# EAGLE design succh_punker (EAGLE 9.6.2)
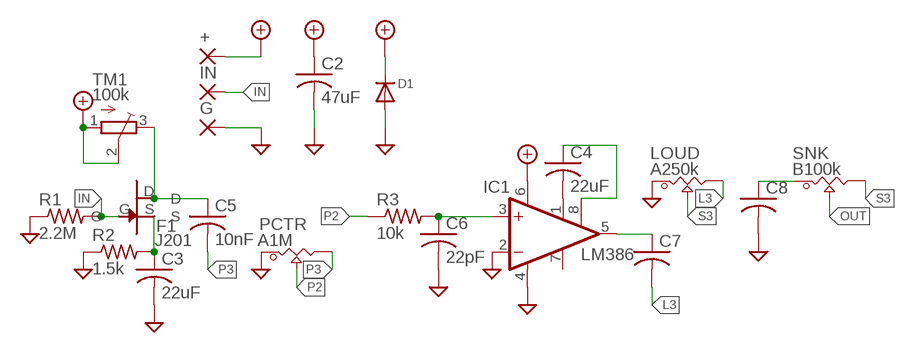
[diagram p0: schematic, sheet 1]

## Parts
+  SMD2  [SMD1,27-2,54]
C2  47uF  C-USC1210  [C1210]
C3  22uF  C-USC1210  [C1210]
C4  22uF  C-USC1210  [C1210]
C5  10nF  C-USC0603  [C0603]
C6  22pF  C-USC0603  [C0603]
C7  C-USC0603  [C0603]
C8  C-USC0603  [C0603]
D1  DIODESOD-123  [SOD-123]
F1  J201  MMBFJ201  [MMBFJ201]
G  SMD2  [SMD1,27-2,54]
IC1  LM386  LM386M-1  [SO08]
IN  SMD2  [SMD1,27-2,54]
LOUD  A250k  POT_9MM_SMD  [POT_9MM_SMD]
PCTR  A1M  POT_9MM_SMD  [POT_9MM_SMD]
R1  2.2M  R-US_R0603  [R0603]
R2  1.5k  R-US_R0603  [R0603]
R3  10k  R-US_R0603  [R0603]
SNK  B100k  POT_9MM_SMD  [POT_9MM_SMD]
TM1  100k  TRIMPOTTC33X  [TC33X]

## Nets
+9V: +.1(P) C2.1 D1.C IC1.6(VS) TM1.1(A) TM1.2(S)
F1_D: C5.1 F1.D TM1.3(E)
F1_S: C3.1 F1.S R2.2
GND: C2.2 C3.2 C6.2 C8.2 D1.A G.1(P) IC1.2(-IN) IC1.4(GND) LOUD.1 PCTR.1 R1.1 R2.1
IN: F1.G IN.1(P) R1.2
L3: C7.2 LOUD.3
N$5: C4.2 IC1.1(GAIN)
N$6: C8.1 SNK.1
N$7: C4.1 IC1.8(GAIN)
OA_+: C6.1 IC1.3(+IN) R3.2
OA_O: C7.1 IC1.5(OUT)
OUT: SNK.2
P2: PCTR.2 R3.1
P3: C5.2 PCTR.3
S3: LOUD.2 SNK.3
Unconnected: IC1.7(BYPASS)

## Library data of the parts
+ G IN = wirepad:SMD2: SMD PAD
C2-C8 = adafruit:C-US: CAPACITOR, American symbol
D1 = adafruit:DIODE: Diode SMADIODE - SMA Surface Mount Package 20V 1A Schottky Diode Digikey: 641-1014-6-ND DO-1N4148 - Through Hole Small Current Diode SOD-123 20V 1 A (.5mV Vf) Schottky Diode - Digikey: MBRX120TPMSCT-ND SOD-323 10V 570mA (.38mV Vf, 3ns) Schottky Diode - Digikey: ZLLS410CT-ND SOD-523 30V 30mA Schottky Diode (RB751S-40TE61) - Digikey: RB751S-40TE61CT-ND SOT23-R/W - SOT23 Package (R = Solder Paste/Reflow Ovens, W = Hand-Soldering) BAT54Film 40V 300mA - Digikey: 497-7162-1-ND
F1 = SOT95P240X110-3N:MMBFJ201
IC1 = linear:LM386?-*: Low Voltage Audio Power Amplifier Source: http://cache.national.com/ds/LM/LM386.pdf
LOUD PCTR SNK = Potentiometers_SMD:POT_9MM_SMD
R1-R3 = adafruit:R-US_: RESISTOR, American symbol
TM1 = adafruit:TRIMPOT: SMT trimmer potentiometer part number TC33X http://www.ladyada.net/library/eagle

## Board
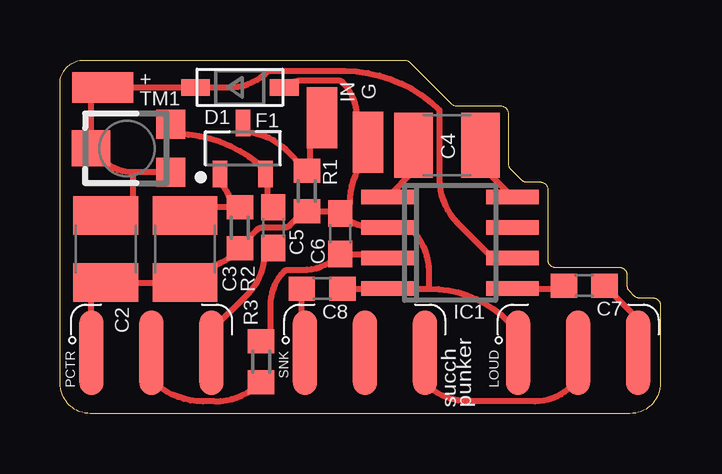
[diagram p1: board, top side]

Size 25.02 x 14.73 mm. Coordinates in mm from the lower left corner, seen from the top.
Outline: 25.02,4.51 25.02,1.27 arc-90 23.75,0 1.27,0 arc-90 0,1.27 0,13.73 arc-90 1,14.73 14.35,14.73 arc-45 14.57,14.64 16.29,12.92 arc45 16.52,12.83 18.35,12.83 arc-90 18.67,12.51 18.67,10.42 arc45 18.76,10.19 19.21,9.74 arc45 19.44,9.65 20,9.65 arc-90 20.32,9.34 20.32,6.41 arc90 20.64,6.1 23.3,6.1 arc-90 23.62,5.78 23.62,5.34 arc45 23.71,5.11 23.91,4.92 arc45 24.14,4.83 24.7,4.83 arc-90 25.02,4.51
Copper layers (1*16): Top 0.035mm / dielectric 1.5mm / Bottom 0.035mm
Design rules "default *": minimum track width 6mil, minimum drill 0.35mm, track to track 6mil, track to pad 6mil, pad to pad 6mil, via to via 6mil, smd to smd 6mil, copper to edge 10mil, drill to drill 6mil, minimum pad ring 10mil, minimum via ring 8mil, stop-mask expansion 4mil, vias tented up to drill 0mil, thermal gap 10mil

### Footprints (pad centres in the part's own frame; a part is rotated, then mirrored left to right if it is on the bottom)
SMD1,27-2,54 = smd 1.27 x 2.54: 1 0,0
C1210 = smd 1.6 x 2.7: 1 -1.4,0; 2 1.4,0
C0603 = smd 1.1 x 1: 1 -0.85,0; 2 0.85,0
SOD-123 = smd 1.2 x 0.7: A 1.85,0; C -1.85,0
MMBFJ201 = smd 1.099 x 0.602: D -1.065,-0.95; G 1.065,0; S -1.065,0.95
SO08 = smd 0.6 x 2.2: 1 -1.905,-2.6; 2 -0.635,-2.6; 3 0.635,-2.6; 4 1.905,-2.6; 5 1.905,2.6; 6 0.635,2.6; 7 -0.635,2.6; 8 -1.905,2.6
POT_9MM_SMD = smd 0.991 x 3.505: 1 -2.5,0; 2 0,0; 3 2.5,0
R0603 = smd 1 x 1.1: 1 -0.85,0; 2 0.85,0
TC33X = smd 1.2 x 1.2: 1 -1,-1.825; 3 1,-1.825 | smd 1.5 x 1.6: 2 0,1.5

### Placement (x,y rotation side)
+  1.78,13.59 90 top
C2  1.91,6.86 270 top
C3  5.21,6.86 270 top
C4  16.13,11.18 180 top
C5  8.89,7.75 270 top
C6  11.68,7.49 90 top
C7  21.84,5.33 0 top
C8  10.92,5.21 0 top
D1  7.49,13.59 0 top
F1  7.62,11.05 90 top
G  12.83,11.3 0 top
IC1  16.26,7.11 270 top
IN  10.92,12.32 0 top
LOUD  21.59,2.54 0 top
PCTR  3.81,2.54 0 top
R1  10.29,9.27 90 top
R2  7.49,7.75 90 top
R3  8.38,2.16 90 top
SNK  12.7,2.54 0 top
TM1  2.79,11.05 90 top

### Tracks (layer width: path | path; a pad name or v marks a point on that pad's centre or on a via)
+9V
  Top 0.254: TM1.1 3.05,10.05 | 3.05,10.05 arc-45 1.76,10.58 TM1.2 1.29,13.11 +.1 D1.C 7.03,13.59 arc45 8.68,14.28 11.87,14.28 arc-45 15.81,12.64 15.81,9.76 arc45 16.55,7.96 18.03,6.48 IC1.6 | C2.1 2.41,8.76 3.05,8.76 3.05,10.05
F1_D
  Top 0.254: C5.1 8.64,8.85 8.64,9.92 F1.D 8.57,10.12 arc45 4.91,11.63 4.62,11.92 TM1.3
F1_S
  Top 0.254: C3.1 5.55,8.6 7.11,8.6 | R2.2 7.11,8.6 | 7.11,8.6 arc45 6.71,9.56 6.67,9.6 F1.S
GND
  Top 0.254: PCTR.1 1.31,5.29 1.27,5.33 1.39,5.46 C2.2 C3.2 5.84,6.09 arc45 7.29,6.69 R2.1 7.49,6.95 8.17,7.63 arc-45 8.52,7.77 9.4,7.77 arc45 9.58,7.84 10.16,8.42 R1.1 11.61,8.42 C6.2 | C8.2 IC1.4 15.37,5.21 | C6.2 arc45 13.12,7.75 IC1.2 14.56,7.75 14.62,7.69 arc-45 15.37,5.89 15.37,5.21 | 15.37,5.21 15.37,5.21 arc-45 18.68,3.83 19.09,3.43 LOUD.1 | C6.2 12.06,8.72 12.06,8.83 arc-45 12.83,10.67 G.1 12.83,11.94 12.34,12.42 arc45 11.77,13.81 arc45 11.63,13.87 10.02,13.87 arc45 D1.A
IN
  Top 0.254: F1.G 7.62,11.73 arc-45 9.42,10.99 10.14,10.27 | 10.14,10.27 R1.2 | IN.1 10.41,11.81 10.41,10.54 10.14,10.27
L3
  Top 0.254: C7.2 24.09,3.94 LOUD.3
N$5
  Top 0.254: IC1.1 14.73,10.09 C4.2
N$6
  Top 0.254: SNK.1 10.07,2.67 C8.1
N$7
  Top 0.254: IC1.8 17.53,10.34 C4.1
OA_+
  Top 0.254: R3.2 8.76,3.39 8.76,4.54 arc-45 9.33,5.91 arc-45 9.51,5.99 10.1,5.99 arc45 C6.1 13.49,6.64 IC1.3
OA_O
  Top 0.254: IC1.5 20.87,5.21 C7.1
P2
  Top 0.254: R3.1 arc-45 6.45,0.51 5.96,0.51 arc-45 3.81,1.4 PCTR.2
P3
  Top 0.254: C5.2 8.76,6.9 8.51,6.64 arc-45 7.82,4.97 6.31,3.46 PCTR.3
S3
  Top 0.254: LOUD.2 21.32,2.27 21.32,1.14 arc-45 19.78,0.51 17.04,0.51 arc-45 15.2,1.27 SNK.3

### Text on the board
tPlace: succh | punker